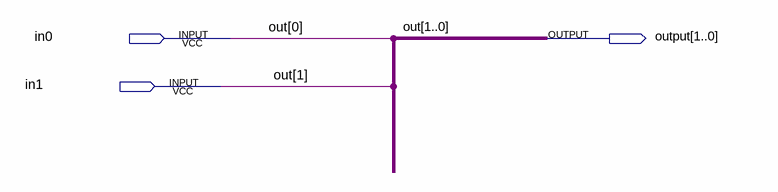
[diagram p0: schematic sheet]
// Quartus schematic in2_output.bdf as structural Verilog: 0 symbols, 3 pins
module in2_output (
  input  in0,
  input  in1,
  output [1:0] \output 
);


  assign \output  = {in1, in0};

  // Other names for the same wires on the sheet: out[1:0] = {in1, in0}
endmodule
